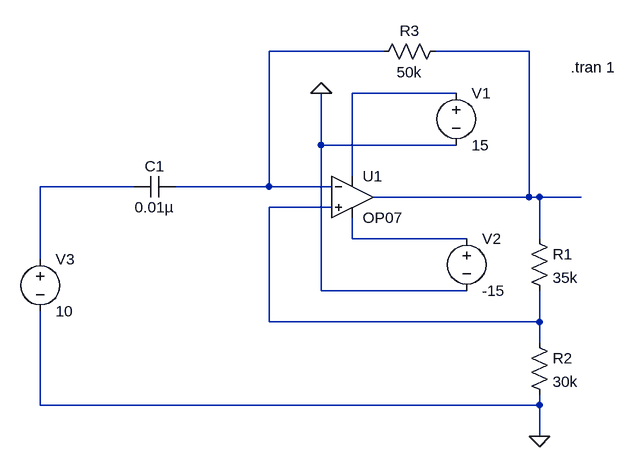
[diagram p0: schematic opamp-Astable.asc]
opamp-Astable.asc, the LTspice schematic file:
Version 4.1
SHEET 1 880 680
WIRE 176 -48 0 -48
WIRE 400 -48 256 -48
WIRE 288 16 128 16
WIRE 80 96 80 16
WIRE 288 96 80 96
WIRE 128 144 128 16
WIRE -208 160 -352 160
WIRE 0 160 0 -48
WIRE 0 160 -144 160
WIRE 96 160 0 160
WIRE 400 176 400 -48
WIRE 400 176 160 176
WIRE 416 176 400 176
WIRE 480 176 416 176
WIRE 96 192 0 192
WIRE 128 240 128 208
WIRE 304 240 128 240
WIRE 416 240 416 176
WIRE -352 272 -352 160
WIRE 80 320 80 96
WIRE 304 320 80 320
WIRE 0 368 0 192
WIRE 416 368 416 320
WIRE 416 368 0 368
WIRE 416 400 416 368
WIRE -352 496 -352 352
WIRE 416 496 416 480
WIRE 416 496 -352 496
WIRE 416 544 416 496
FLAG 80 16 0
FLAG 416 544 0
SYMBOL OpAmps\\OP07 128 112 R0
SYMATTR InstName U1
SYMBOL voltage 288 0 R0
WINDOW 123 0 0 Left 0
WINDOW 39 0 0 Left 0
SYMATTR InstName V1
SYMATTR Value 15
SYMBOL voltage 304 224 R0
WINDOW 123 0 0 Left 0
WINDOW 39 0 0 Left 0
SYMATTR InstName V2
SYMATTR Value -15
SYMBOL res 400 224 R0
SYMATTR InstName R1
SYMATTR Value 35k
SYMBOL res 400 384 R0
SYMATTR InstName R2
SYMATTR Value 30k
SYMBOL cap -144 144 R90
WINDOW 0 0 32 VBottom 2
WINDOW 3 32 32 VTop 2
SYMATTR InstName C1
SYMATTR Value 0.01µ
SYMBOL res 272 -64 R90
WINDOW 0 0 56 VBottom 2
WINDOW 3 32 56 VTop 2
SYMATTR InstName R3
SYMATTR Value 50k
SYMBOL voltage -352 256 R0
WINDOW 123 0 0 Left 0
WINDOW 39 0 0 Left 0
SYMATTR InstName V3
SYMATTR Value 10
TEXT 464 -24 Left 2 !.tran 1

The netlist it stands for:
* opamp-Astable.asc
X§U1 N005 N001 N003 N006 N002 LT1001  ; OP07, pins In+ In- V+ V- OUT
V1 N003 0 15
V2 N006 0 -15
R1 N002 N005 35k
R2 N005 0 30k
C1 N001 N004 0.01µ
R3 N002 N001 50k
V3 N004 0 10
.tran 1
.lib LTC.lib
.backanno
.end